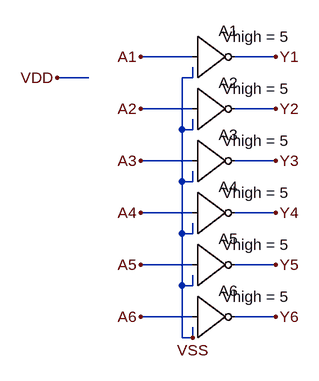
[diagram p0: schematic 74hc04.asc]
74hc04.asc, the LTspice schematic file:
Version 4
SHEET 1 1612 680
WIRE 352 -48 272 -48
WIRE 480 -48 416 -48
WIRE 192 -16 144 -16
WIRE 352 -16 352 -32
WIRE 352 -16 336 -16
WIRE 352 32 272 32
WIRE 480 32 416 32
WIRE 336 64 336 -16
WIRE 352 64 352 48
WIRE 352 64 336 64
WIRE 352 112 272 112
WIRE 480 112 416 112
WIRE 336 144 336 64
WIRE 352 144 352 128
WIRE 352 144 336 144
WIRE 352 192 272 192
WIRE 480 192 416 192
WIRE 336 224 336 144
WIRE 352 224 352 208
WIRE 352 224 336 224
WIRE 352 272 272 272
WIRE 480 272 416 272
WIRE 336 304 336 224
WIRE 352 304 352 288
WIRE 352 304 336 304
WIRE 352 352 272 352
WIRE 480 352 416 352
WIRE 336 384 336 304
WIRE 352 384 352 368
WIRE 352 384 336 384
FLAG 352 384 VSS
FLAG 272 -48 A1
FLAG 272 32 A2
FLAG 272 112 A3
FLAG 272 192 A4
FLAG 272 272 A5
FLAG 272 352 A6
FLAG 480 -48 Y1
FLAG 480 32 Y2
FLAG 480 112 Y3
FLAG 480 192 Y4
FLAG 480 272 Y5
FLAG 480 352 Y6
FLAG 144 -16 VDD
SYMBOL Digital\\inv 352 -112 R0
WINDOW 3 46 33 Left 2
SYMATTR InstName A1
SYMATTR Value Vhigh = 5
SYMBOL Digital\\inv 352 -32 R0
WINDOW 3 46 33 Left 2
SYMATTR InstName A2
SYMATTR Value Vhigh = 5
SYMBOL Digital\\inv 352 48 R0
WINDOW 3 46 33 Left 2
SYMATTR InstName A3
SYMATTR Value Vhigh = 5
SYMBOL Digital\\inv 352 128 R0
WINDOW 3 46 33 Left 2
SYMATTR InstName A4
SYMATTR Value Vhigh = 5
SYMBOL Digital\\inv 352 208 R0
WINDOW 3 46 33 Left 2
SYMATTR InstName A5
SYMATTR Value Vhigh = 5
SYMBOL Digital\\inv 352 288 R0
WINDOW 3 46 33 Left 2
SYMATTR InstName A6
SYMATTR Value Vhigh = 5

The netlist it stands for:
* 74hc04.asc
A1 A1 VSS VSS VSS VSS Y1 VSS VSS BUF Vhigh = 5
A2 A2 VSS VSS VSS VSS Y2 VSS VSS BUF Vhigh = 5
A3 A3 VSS VSS VSS VSS Y3 VSS VSS BUF Vhigh = 5
A4 A4 VSS VSS VSS VSS Y4 VSS VSS BUF Vhigh = 5
A5 A5 VSS VSS VSS VSS Y5 VSS VSS BUF Vhigh = 5
A6 A6 VSS VSS VSS VSS Y6 VSS VSS BUF Vhigh = 5
.backanno
.end